# Altium schematic sheet [15] - POWER SEQUENCING_competition.SchDoc
size A2; DocumentNumber: 2; SheetNumber: 2; SheetTotal: 4
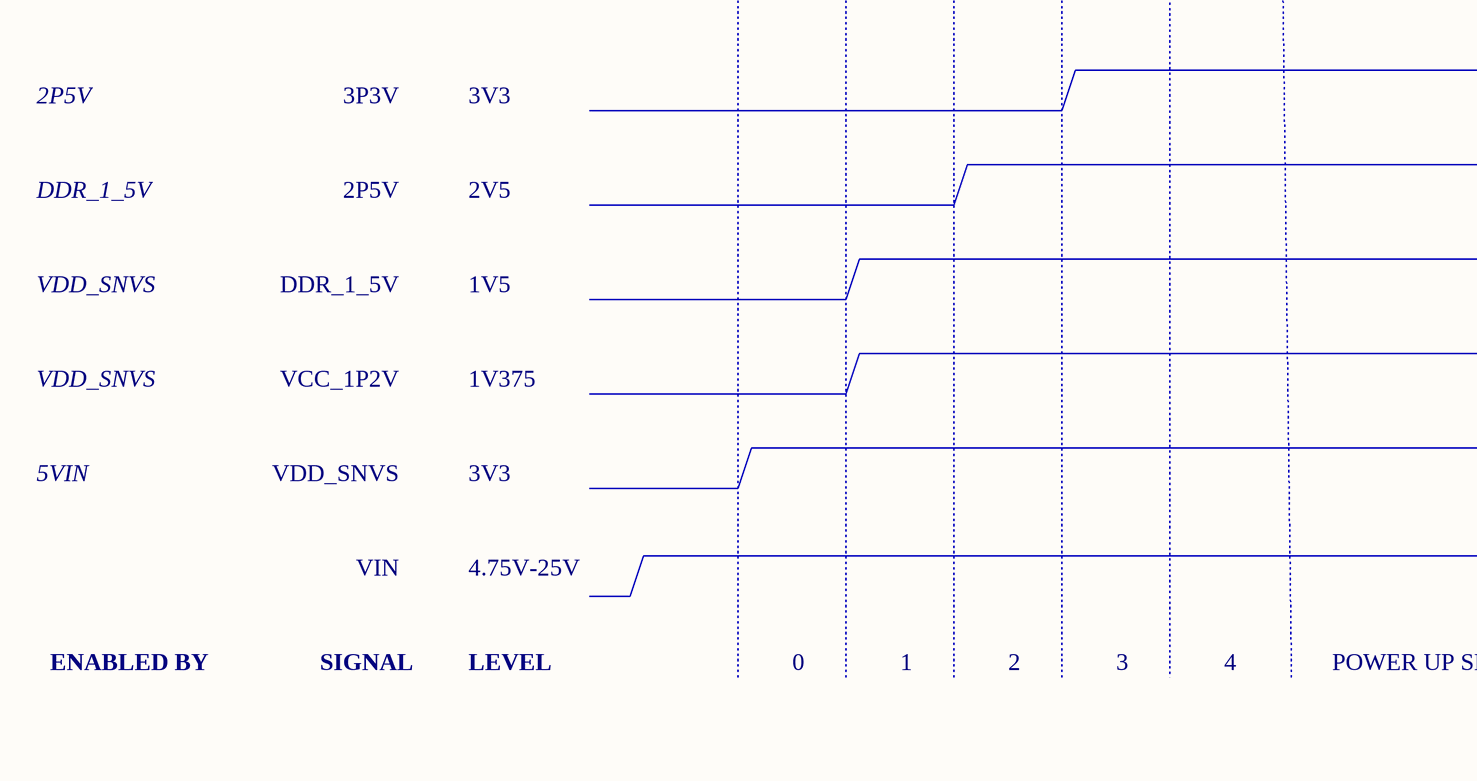
[diagram p0: [15] - POWER SEQUENCING_competition.SchDoc, left]
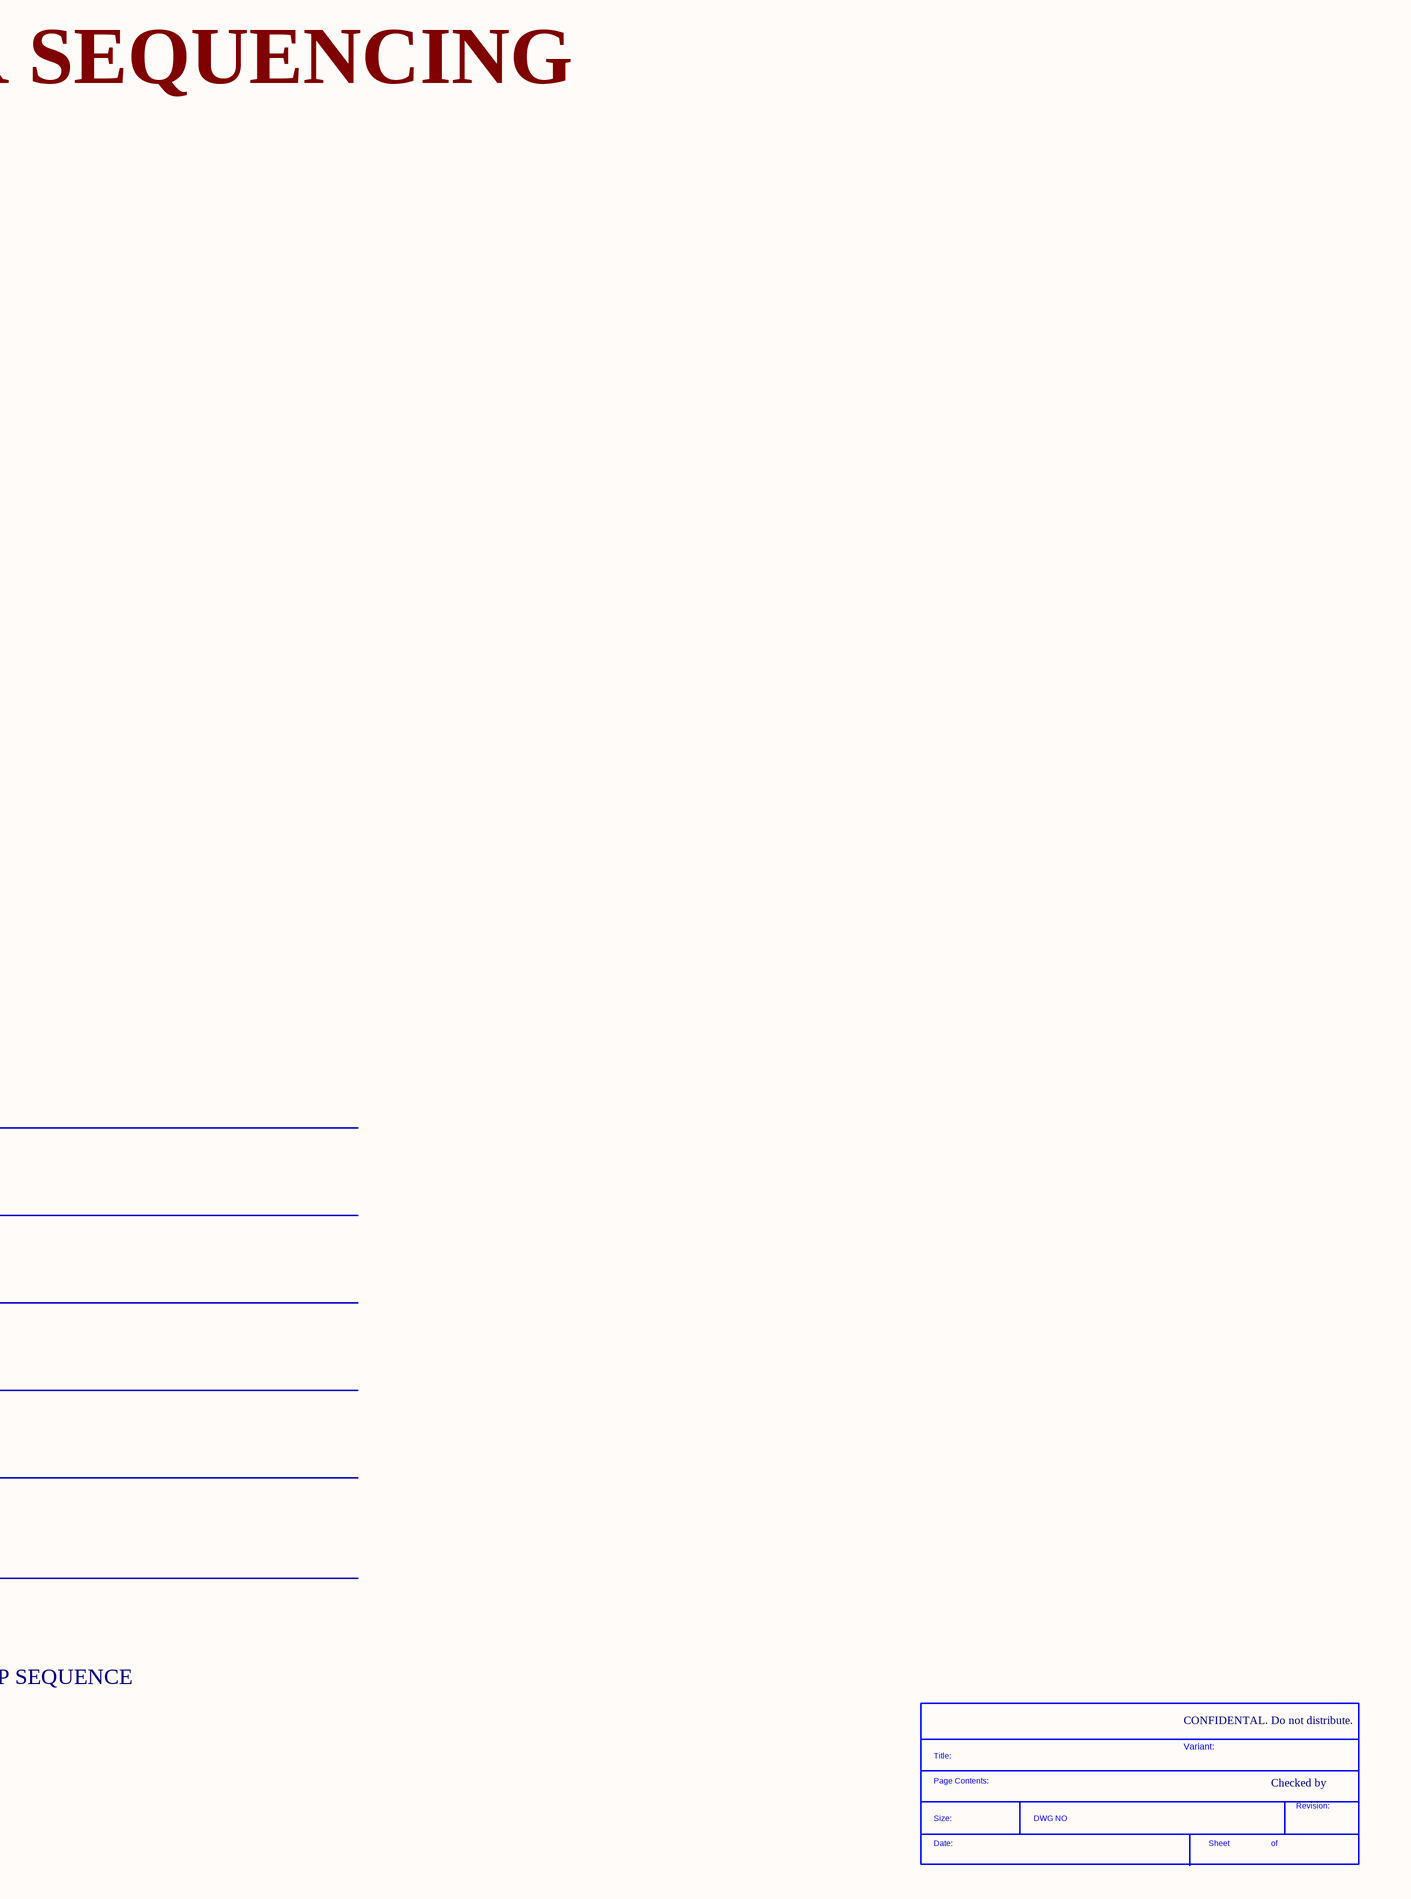
[diagram p1: [15] - POWER SEQUENCING_competition.SchDoc, right]

## Parts
*  SDTitleBlock  (value not drawn)  (graphical)

## Notes on the sheet
- CPU - POWER SEQUENCING
- 2P5V
- 3P3V
- 3V3
- DDR_1_5V
- 2V5
- VDD_SNVS
- 1V5
- VCC_1P2V
- 1V375
- 5VIN
- VIN
- 4.75V-25V
- ENABLED BY
- SIGNAL
- LEVEL
- 0
- 1
- 2
- 3
- 4
- POWER UP SEQUENCE
- CONFIDENTAL. Do not distribute.
- Variant:
- Checked by
- (in symbol SDTitleBlock) Title:; Page Contents:; Revision:; Size:; DWG NO; Date:; Sheet; of